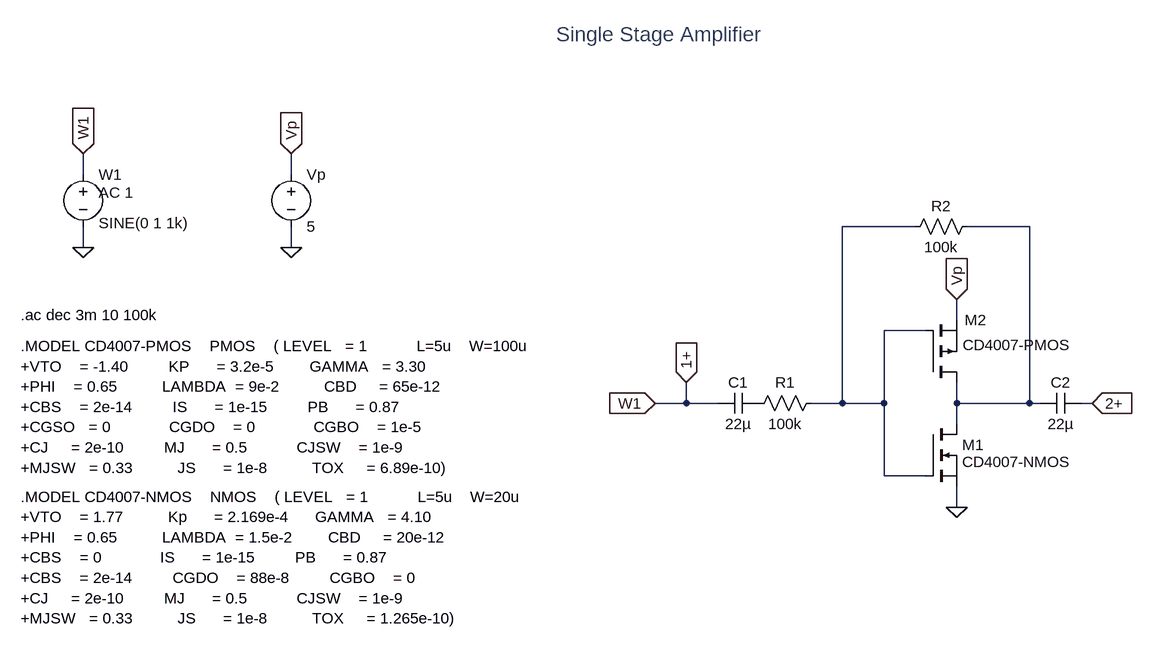
[diagram p0: schematic cmos_amplifier_hardware_setup_2a.asc]
cmos_amplifier_hardware_setup_2a.asc, the LTspice schematic file:
Version 4
SHEET 1 6340 1512
WIRE -960 832 -960 800
WIRE -640 832 -640 800
WIRE 320 912 208 912
WIRE 496 912 400 912
WIRE -960 944 -960 912
WIRE -640 944 -640 912
WIRE 384 1056 384 1024
WIRE 336 1072 272 1072
WIRE -32 1184 -32 1152
WIRE -32 1184 -80 1184
WIRE 16 1184 -32 1184
WIRE 208 1184 208 912
WIRE 208 1184 160 1184
WIRE 272 1184 272 1072
WIRE 272 1184 208 1184
WIRE 384 1184 384 1152
WIRE 496 1184 496 912
WIRE 496 1184 384 1184
WIRE 512 1184 496 1184
WIRE 592 1184 576 1184
WIRE 384 1216 384 1184
WIRE 272 1296 272 1184
WIRE 336 1296 272 1296
WIRE 384 1344 384 1312
FLAG 384 1344 0
FLAG 384 1024 Vp
IOPIN 384 1024 In
FLAG -80 1184 W1
IOPIN -80 1184 In
FLAG -960 944 0
FLAG -640 944 0
FLAG -640 800 Vp
IOPIN -640 800 In
FLAG -960 800 W1
IOPIN -960 800 In
FLAG -32 1152 1+
IOPIN -32 1152 In
FLAG 592 1184 2+
IOPIN 592 1184 In
SYMBOL nmos 336 1216 R0
WINDOW 3 56 58 Left 2
SYMATTR Value CD4007-NMOS
SYMATTR InstName M1
SYMBOL pmos 336 1152 M180
WINDOW 3 57 58 Left 2
WINDOW 0 60 96 Left 2
SYMATTR Value CD4007-PMOS
SYMATTR InstName M2
SYMBOL voltage -640 816 R0
WINDOW 123 0 0 Left 0
WINDOW 39 0 0 Left 0
SYMATTR InstName Vp
SYMATTR Value 5
SYMBOL res 176 1168 R90
WINDOW 0 0 56 VBottom 2
WINDOW 3 32 56 VTop 2
SYMATTR InstName R1
SYMATTR Value 100k
SYMBOL res 416 896 R90
WINDOW 0 0 56 VBottom 2
WINDOW 3 32 56 VTop 2
SYMATTR InstName R2
SYMATTR Value 100k
SYMBOL cap 80 1168 R90
WINDOW 0 0 32 VBottom 2
WINDOW 3 32 32 VTop 2
SYMATTR InstName C1
SYMATTR Value 22µ
SYMBOL cap 576 1168 R90
WINDOW 0 0 32 VBottom 2
WINDOW 3 32 32 VTop 2
SYMATTR InstName C2
SYMATTR Value 22µ
SYMBOL voltage -960 816 R0
WINDOW 3 24 91 Left 2
WINDOW 123 24 44 Left 2
WINDOW 39 0 0 Left 0
SYMATTR Value SINE(0 1 1k)
SYMATTR Value2 AC 1
SYMATTR InstName W1
TEXT -1056 1328 Left 2 !.MODEL CD4007-NMOS    NMOS    ( LEVEL   = 1           L=5u    W=20u             \n+VTO    = 1.77          Kp      = 2.169e-4      GAMMA   = 4.10  \n+PHI    = 0.65          LAMBDA  = 1.5e-2        CBD     = 20e-12\n+CBS    = 0             IS      = 1e-15         PB      = 0.87\n+CBS    = 2e-14         CGDO    = 88e-8         CGBO    = 0\n+CJ     = 2e-10         MJ      = 0.5           CJSW    = 1e-9\n+MJSW   = 0.33          JS      = 1e-8          TOX     = 1.265e-10)
TEXT -1056 1096 Left 2 !.MODEL CD4007-PMOS    PMOS    ( LEVEL   = 1           L=5u    W=100u                \n+VTO    = -1.40         KP      = 3.2e-5        GAMMA   = 3.30  \n+PHI    = 0.65          LAMBDA  = 9e-2          CBD     = 65e-12\n+CBS    = 2e-14         IS      = 1e-15         PB      = 0.87\n+CGSO   = 0             CGDO    = 0             CGBO    = 1e-5\n+CJ     = 2e-10         MJ      = 0.5           CJSW    = 1e-9\n+MJSW   = 0.33          JS      = 1e-8          TOX     = 6.89e-10)
TEXT -232 616 Left 3 ;Single Stage Amplifier
TEXT -1056 1048 Left 2 !.ac dec 3m 10 100k

The netlist it stands for:
* cmos_amplifier_hardware_setup_2a.asc
M1 N002 N001 0 0 CD4007-NMOS
M2 N002 N001 Vp Vp CD4007-PMOS
Vp Vp 0 5
R1 N001 P001 100k
R2 N002 N001 100k
C1 P001 1+ 22µ
C2 2+ N002 22µ
V§W1 1+ 0 SINE(0 1 1k) AC 1
.model NMOS NMOS
.model PMOS PMOS
.lib standard.mos
.MODEL CD4007-NMOS    NMOS    ( LEVEL   = 1           L=5u    W=20u
+VTO    = 1.77          Kp      = 2.169e-4      GAMMA   = 4.10
+PHI    = 0.65          LAMBDA  = 1.5e-2        CBD     = 20e-12
+CBS    = 0             IS      = 1e-15         PB      = 0.87
+CBS    = 2e-14         CGDO    = 88e-8         CGBO    = 0
+CJ     = 2e-10         MJ      = 0.5           CJSW    = 1e-9
+MJSW   = 0.33          JS      = 1e-8          TOX     = 1.265e-10)
.MODEL CD4007-PMOS    PMOS    ( LEVEL   = 1           L=5u    W=100u
+VTO    = -1.40         KP      = 3.2e-5        GAMMA   = 3.30
+PHI    = 0.65          LAMBDA  = 9e-2          CBD     = 65e-12
+CBS    = 2e-14         IS      = 1e-15         PB      = 0.87
+CGSO   = 0             CGDO    = 0             CGBO    = 1e-5
+CJ     = 2e-10         MJ      = 0.5           CJSW    = 1e-9
+MJSW   = 0.33          JS      = 1e-8          TOX     = 6.89e-10)
* Single Stage Amplifier
.ac dec 3m 10 100k
.backanno
.end